# Altium schematic sheet STN1170_RN-42 SW_CAN Rev2.SchDoc: STN1110 RN-42 Bluetooth Board
size B; DrawnBy: AHonecker; Organization: AH Design; Address1: Designed and; Address2: Produced in NY; Address3: USA; DocumentNumber: 3; Revision: 1; SheetNumber: 3; SheetTotal: 3
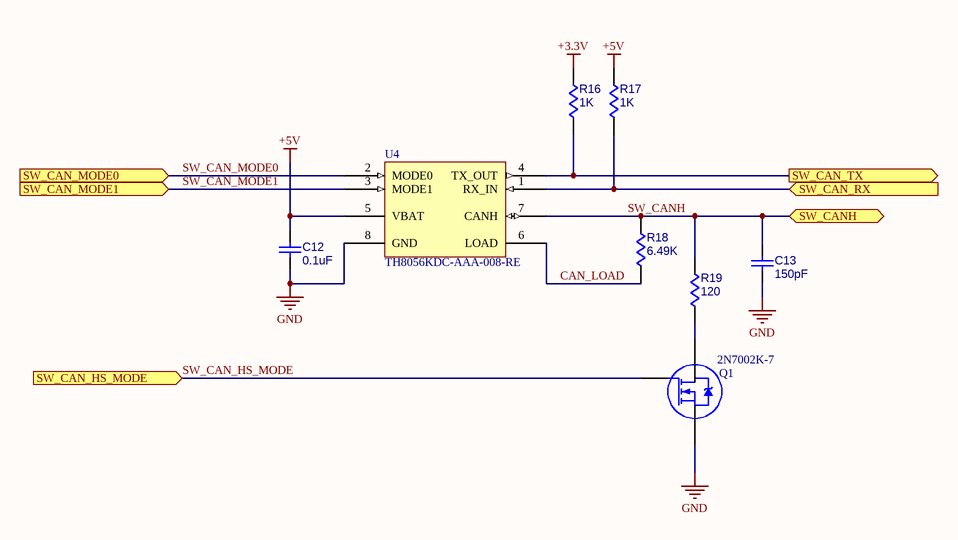
[diagram p0: STN1170_RN-42 SW_CAN Rev2.SchDoc]

## Parts
C12  0.1uF  [CC0603]
C13  150pF  [CC0603]
Q1  2N7002K-7  [SOT23]
R16  1K  [R0603]
R17  1K  [R0603]
R18  6.49K  [R0603]
R19  120  [R1210]
U4  TH8056KDC-AAA-008-RE  [SOIC127P600X172-8L]

## Ports
SW_CAN_HS_MODE (in), SW_CAN_MODE0 (in), SW_CAN_MODE1 (in), SW_CAN_RX (in), SW_CAN_TX (out), SW_CANH (bidir)

## Nets
+3.3V: R16.2
+5V: C12.1 R17.2 U4.5(VBAT)
GND: C12.2 C13.1 Q1.2(Source) U4.8(GND)
CAN_LOAD: R18.1 U4.6(LOAD)
SW_CAN_HS_MODE: Q1.1(Gate) ; port SW_CAN_HS_MODE
SW_CAN_MODE0: U4.2(MODE0) ; port SW_CAN_MODE0
SW_CAN_MODE1: U4.3(MODE1) ; port SW_CAN_MODE1
SW_CAN_RX: R17.1 U4.1(RX_IN) ; port SW_CAN_RX
SW_CAN_TX: R16.1 U4.4(TX_OUT) ; port SW_CAN_TX
SW_CANH: C13.2 R18.2 R19.2 U4.7(CANH) ; port SW_CANH
NetQ1_3: Q1.3(Drain) R19.1

## Notes on the sheet
- Project:
- Variant:
- Title
- Size:
- Date:
- B
- Number:
- Time:
- Sheet
- of
- Rev:
- File:
- Drawn By:
- Checked By:

## Library data of the parts
C12 = 0.1uF,50V,CC0603,X7R,+/-20%: 0.1uF 50V, in a CC0603, X7R ,+/-20%,LF; Manufacturer: Kemet; PartNumber: C0603C104M5RAC; Voltage: 50; Designator: C?; Component Subkind: Capacitor; Approved: Pending; Value: 0.1uF; LeadFree: Yes; RoHS: Yes; Published: 7/18/2007; Publisher: AltiumdBManager; ItemID: 0.1uF,50V,CC0603,X7R,+/-20%; Component Kind: Standard; Component Type: Standard; Manufacturer2: CAL-CHIP; Manufacturer3: -; Manufacturer4: -; Pin Count: 2; PartNumber2: GMC10X7R10450NT-LF; Material: X7R; Tolerance: +/-20%; ComponentLink1URL: \PassivesDatasheets\F3102_CE.pdf; ComponentLink2URL: \PassivesDatasheets\gmc_series.pdf; ComponentLink3URL: -; ComponentLink4URL: -; ComponentLink1Description: Datasheet; ComponentLink2Description: Datasheet; ComponentLink3Description: Datasheet; ComponentLink4Description: Datasheet
C13 = 150pF,50V,CC0603,X7R,+/-20%: 150pF 50V, in a CC0603, X7R ,+/-20%,LF; Manufacturer: Yageo; PartNumber: CC0603M*X7R9BB151; Voltage: 50; Designator: C?; Component Subkind: Capacitor; Approved: Pending; Value: 150pF; LeadFree: Yes; RoHS: Yes; Published: 7/18/2007; Publisher: AltiumdBManager; ItemID: 150pF,50V,CC0603,X7R,+/-20%; Component Kind: Standard; Component Type: Standard; Manufacturer2: -; Manufacturer3: -; Manufacturer4: -; Pin Count: 2; Material: X7R; Tolerance: +/-20%; ComponentLink1URL: \PassivesDatasheets\PSG_2006.pdf; ComponentLink2URL: -; ComponentLink3URL: -; ComponentLink4URL: -; ComponentLink1Description: Datasheet; ComponentLink2Description: Datasheet; ComponentLink3Description: Datasheet; ComponentLink4Description: Datasheet
Q1 = 2N7002K-7: N-Channel MOSFET, 60V, 0.300A, 2ohms, SOT23; Manufacturer: Diodes, Inc.; PartNumber: 2N7002K-7
R16 R17 = 1K,R0603,5%: 1K, Gen Purp Chip, R0603 0.1W 5%; Manufacturer: Panasonic; PartNumber: ERJ3GEYJ102V; Component SubKind: Resistor; Voltage: 75; MetricFootprint: R1608MM; Value: 1K; Manufacturer2: Vishay/Dale; Manufacturer3: KOA/Speer; Manufacturer4: ROHM; PartNumber2: CRCW06031KJKED; PartNumber3: RK73B1JTTD102J; PartNumber4: MCR03EZPJ102; Tolerance: 5%; Material: Thick-Film; Watts: 0.1W; LeadFree: Yes; RoHS: Yes; Published: 7/16/2009; Publisher: AltiumDBManager1.1; ItemID: 1K,R0603,5%; Component Kind: Standard; Component Type: Standard; Pin Count: 2; Spice Prefix: R; ComponentLink1URL: http://industrial.panasonic.com/www-data/pdf/AOA0000/AOA0000CE1.pdf; ComponentLink2URL: \PassivesDatasheets\Vishay_dcrcw.pdf; ComponentLink3URL: \PassivesDatasheets\KOA_Speer_2%_5%.pdf; ComponentLink4URL: \PassivesDatasheets\mcr03.pdf; ComponentLink1Description: Datasheet; ComponentLink2Description: Datasheet; ComponentLink3Description: Datasheet; ComponentLink4Description: Datasheet
R18 = 6.49K,R0603,1%: 6.49K, Gen Purp Chip, R0603 0.1W 1%; Manufacturer: Panasonic; PartNumber: ERJ3EKF6491V; Component SubKind: Resistor; Voltage: 75; MetricFootprint: R1608MM; Value: 6.49K; Manufacturer2: Vishay/Dale; Manufacturer3: KOA/Speer; Manufacturer4: ROHM; PartNumber2: CRCW06036K49FKED; PartNumber3: RK73H1JTTD6491F; PartNumber4: MCR03EZPFX6491; Tolerance: 1%; Material: Thick-Film; Watts: 0.1W; LeadFree: Yes; RoHS: Yes; Published: 7/16/2009; Publisher: AltiumDBManager1.1; ItemID: 6.49K,R0603,1%; Component Kind: Standard; Component Type: Standard; Pin Count: 2; Spice Prefix: R; ComponentLink1URL: http://industrial.panasonic.com/www-data/pdf/AOA0000/AOA0000CE2.pdf; ComponentLink2URL: \PassivesDatasheets\Vishay_dcrcw.pdf; ComponentLink3URL: \PassivesDatasheets\KOA_Speer_1%_0p5%.pdf; ComponentLink4URL: \PassivesDatasheets\mcr03.pdf; ComponentLink1Description: Datasheet; ComponentLink2Description: Datasheet; ComponentLink3Description: Datasheet; ComponentLink4Description: Datasheet
R19 = 120,R1210,5%: 120, Gen Purp Chip, R1210 0.5W 5%; Manufacturer: Panasonic; PartNumber: ERJ14YJ121U; Component SubKind: Resistor; Voltage: 200; MetricFootprint: R3225MM; Value: 120; Manufacturer2: Vishay/Dale; Manufacturer3: KOA/Speer; Manufacturer4: ROHM; PartNumber2: CRCW1210120RJKED; PartNumber3: RK73B2ETTD121J; PartNumber4: MCR25JZHJ121; Tolerance: 5%; Material: Thick-Film; Watts: 0.5W; LeadFree: Yes; RoHS: Yes; Published: 7/16/2009; Publisher: AltiumDBManager1.1; ItemID: 120,R1210,5%; Component Kind: Standard; Component Type: Standard; Pin Count: 2; Spice Prefix: R; ComponentLink1URL: http://industrial.panasonic.com/www-data/pdf/AOA0000/AOA0000CE1.pdf; ComponentLink2URL: \PassivesDatasheets\Vishay_dcrcw.pdf; ComponentLink3URL: \PassivesDatasheets\KOA_Speer_2%_5%.pdf; ComponentLink4URL: \PassivesDatasheets\mcr25.pdf; ComponentLink1Description: Datasheet; ComponentLink2Description: Datasheet; ComponentLink3Description: Datasheet; ComponentLink4Description: Datasheet
U4 = TH8056KDC-AAA-008-RE: Single-wire CAN transceiver; Manufacturer: Melexis Technologies NV; PartNumber: TH8056KDC-AAA-008-RE